# EAGLE schematic headstageNano16CMOS (EAGLE 7.1.0)
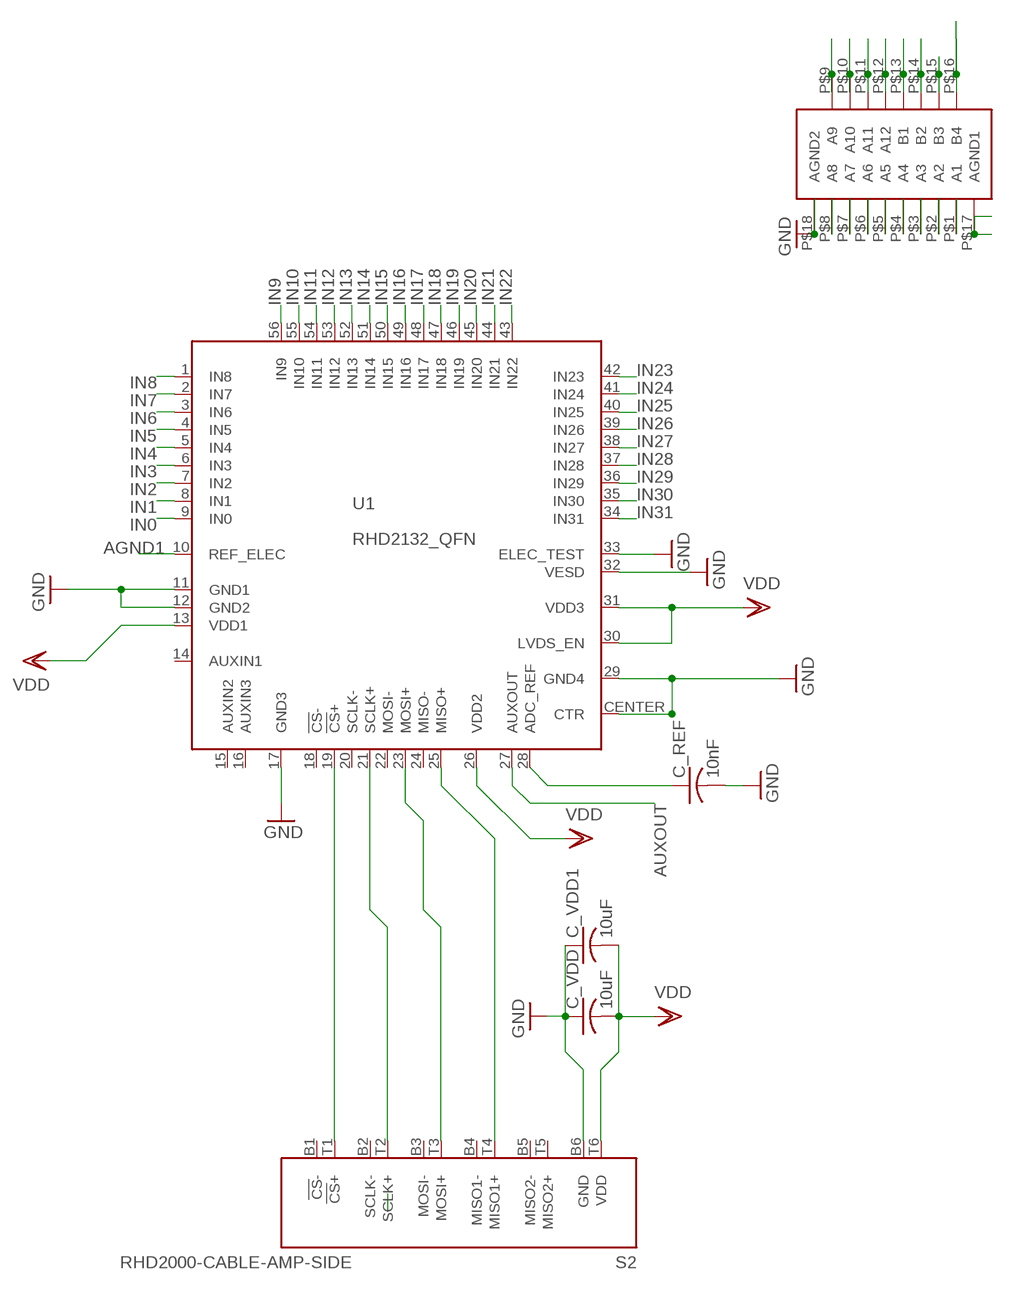
[diagram p0: schematic, sheet 1]

## Parts
C_REF  10nF  C-USC0402K  [C0402K]
C_VDD  10uF  C-USC0402K  [C0402K]
C_VDD1  10uF  C-USC0402K  [C0402K]
S2  RHD2000-CABLE-AMP-SIDE  [OMNETICS_PZN-12-AA]
U1  RHD2132_QFN  [QFN56_8_X_8_LARGE]
U$1  OMNETICS_FE18  [OMNETICS_FE18]

## Nets
ADC_REF: C_REF.1 U1.28(ADC_REF)
AGND1: U1.10(REF_ELEC) U$1.P$17(AGND1)
AUXOUT: U1.27(AUXOUT)
GND: C_REF.2 C_VDD1.1 C_VDD.1 S2.B6(GND) U1.11(GND1) U1.12(GND2) U1.17(GND3) U1.29(GND4) U1.32(VESD) U1.33(ELEC_TEST) U1.CENTER(CTR) U$1.P$18(AGND2)
IN0: U1.9(IN0)
IN1: U1.8(IN1)
IN2: U1.7(IN2)
IN3: U1.6(IN3)
IN4: U1.5(IN4)
IN5: U1.4(IN5)
IN6: U1.3(IN6)
IN7: U1.2(IN7)
IN8: U1.1(IN8) U$1.P$14(B2)
IN9: U1.56(IN9) U$1.P$16(B4)
IN10: U1.55(IN10) U$1.P$1(A1)
IN11: U1.54(IN11) U$1.P$2(A2)
IN12: U1.53(IN12) U$1.P$15(B3)
IN13: U1.52(IN13) U$1.P$3(A3)
IN14: U1.51(IN14) U$1.P$12(A12)
IN15: U1.50(IN15) U$1.P$13(B1)
IN16: U1.49(IN16) U$1.P$5(A5)
IN17: U1.48(IN17) U$1.P$4(A4)
IN18: U1.47(IN18) U$1.P$6(A6)
IN19: U1.46(IN19) U$1.P$7(A7)
IN20: U1.45(IN20) U$1.P$10(A10)
IN21: U1.44(IN21) U$1.P$8(A8)
IN22: U1.43(IN22) U$1.P$9(A9)
IN23: U1.42(IN23) U$1.P$11(A11)
IN24: U1.41(IN24)
IN25: U1.40(IN25)
IN26: U1.39(IN26)
IN27: U1.38(IN27)
IN28: U1.37(IN28)
IN29: U1.36(IN29)
IN30: U1.35(IN30)
IN31: U1.34(IN31)
MOSI2: S2.T3(MOSI+) U1.23(MOSI+)
SCLK+: S2.T1(!CS!+) U1.19(!CS!+)
SCLK-: S2.T2(SCLK+) U1.21(SCLK+)
VDD: C_VDD1.2 C_VDD.2 S2.T4(MISO1+) S2.T6(VDD) U1.13(VDD1) U1.25(MISO+) U1.26(VDD2) U1.30(LVDS_EN) U1.31(VDD3)
Unconnected: S2.B1(!CS!-) S2.B2(SCLK-) S2.B3(MOSI-) S2.B4(MISO1-) S2.B5(MISO2-) S2.T5(MISO2+) U1.14(AUXIN1) U1.15(AUXIN2) U1.16(AUXIN3) U1.18(!CS!-) U1.20(SCLK-) U1.22(MOSI-) U1.24(MISO-)

## Library data of the parts
C_REF C_VDD C_VDD1 = resistor:C-US: CAPACITOR, American symbol
S2 = RHD2000:RHD2000-CABLE-AMP-SIDE
U1 = RHD2000:RHD2132
U$1 = connectorsbottom:OMNETICS_FE18